# EAGLE design HX711 loadcell test hytech v1 (EAGLE 9.5.0)
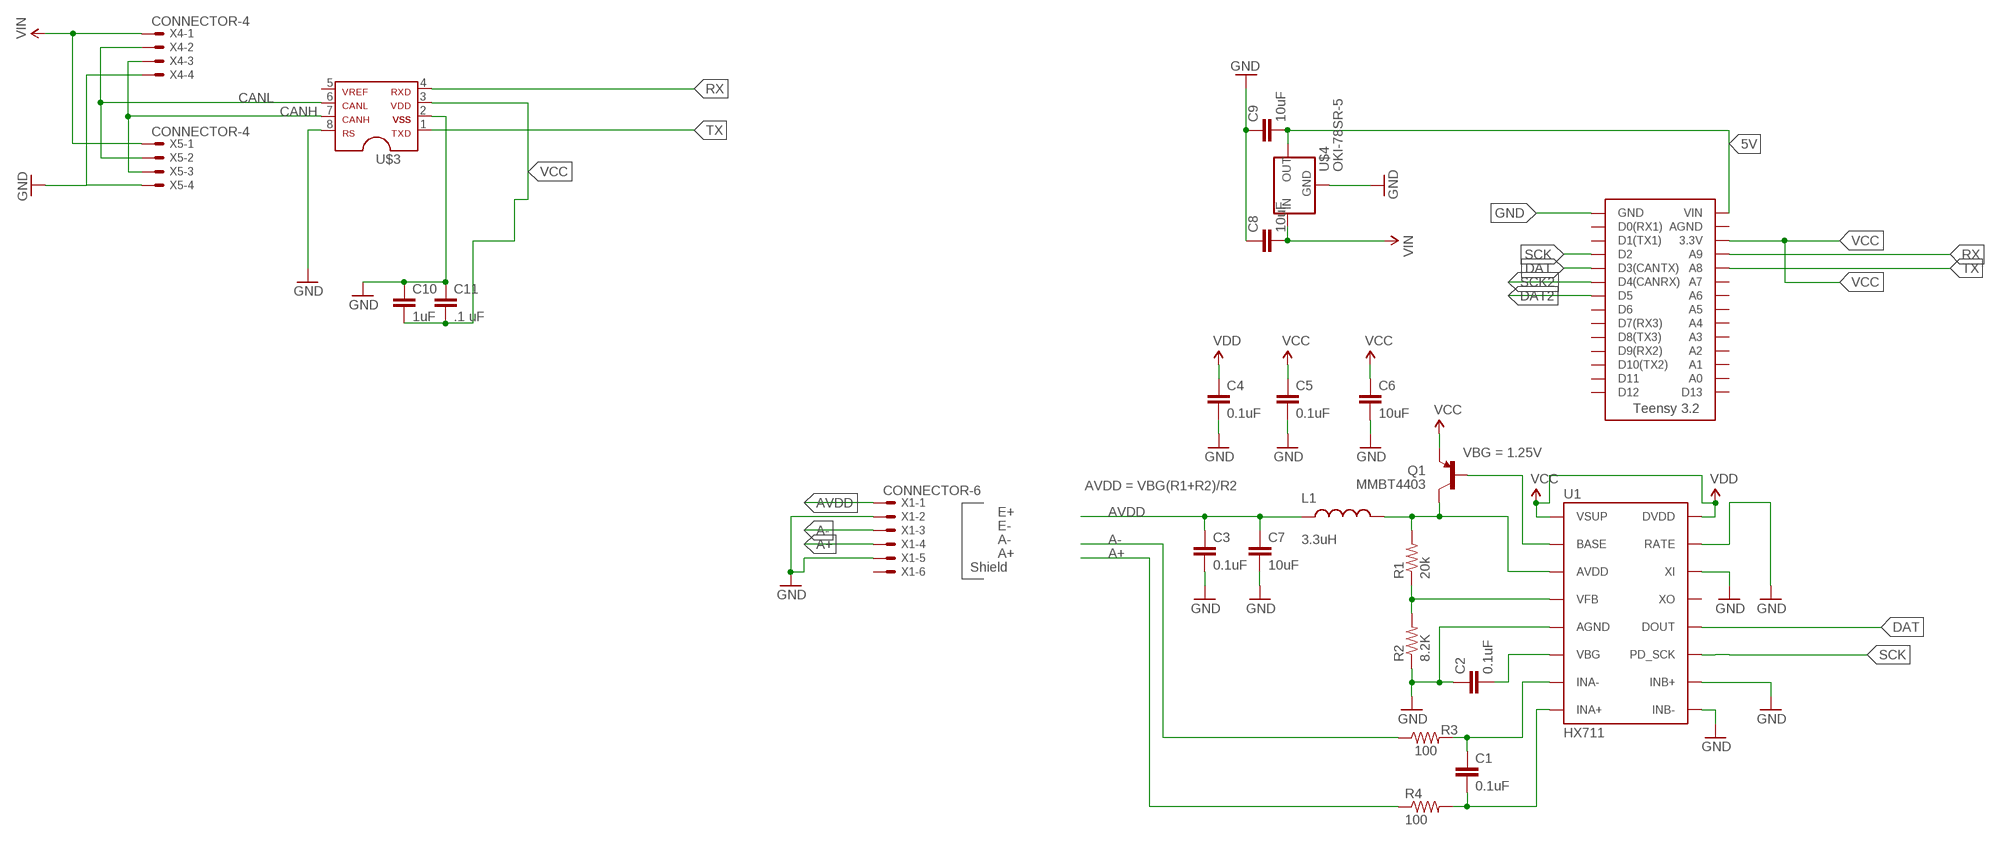
[diagram p0: schematic, sheet 1]

## Parts
C1  0.1uF  0.1UF-25V-5%(0603)  [0603-CAP]
C2  0.1uF  0.1UF-25V-5%(0603)  [0603-CAP]
C3  0.1uF  0.1UF-25V-5%(0603)  [0603-CAP]
C4  0.1uF  0.1UF-25V-5%(0603)  [0603-CAP]
C5  0.1uF  0.1UF-25V-5%(0603)  [0603-CAP]
C6  10uF  10UF50V20%(1210)  [1210]
C7  10uF  10UF50V20%(1210)  [1210]
C8  10uF  CAP0805  [0805]
C9  10uF  CAP0805  [0805]
C10  1uF  CAP0805  [0805]
C11  .1 uF  CAP0805  [0805]
L1  3.3uH  INDUCTOR0805-IND  [0805]
Q1  MMBT4403  TRANSISTOR_PNPMMBT4403  [SOT23-3]
R1  20k  20KOHM1/10W1%(0603)  [0603-RES]
R2  8.2K  8.2KOHM-1/10W-5%(0603)  [0603-RES]
R3  100  100OHM-1/10W-1%(0603)  [0603-RES]
R4  100  100OHM-1/10W-1%(0603)  [0603-RES]
U1  HX711  HX711HX711  [SO16]
U$1  TEENSY_3.2_SIMPLE  [TEENSY_3.2_SIMPLE]
U$3  MCP2551  [SOIC-08]
U$4  OKI-78SR-5  [OKI-78SR]
X1  CONNECTOR-6  [MINIFIT_5566-6]
X4  CONNECTOR-4  [MINIFIT_5566-4]
X5  CONNECTOR-4  [MINIFIT_5566-4]

## Nets
5V: C9.2 U$1.VIN U$4.3(OUT)
A+: R4.1 X1.4
A-: R3.1 X1.3
AVDD: C3.1 C7.1 L1.1 X1.1
CANH: U$3.7 X4.3 X5.3
CANL: U$3.6 X4.2 X5.2
DAT: U1.12(DOUT) U$1.D3(CANTX)
DAT2: U$1.D5
GND: C2.1 C3.2 C4.2 C5.2 C6.2 C7.2 C8.1 C9.1 C10.1 C11.1 R2.1 U1.5(AGND) U1.9(INB-) U1.10(INB+) U1.14(XI) U1.15(RATE) U$1.GND U$3.2 U$3.8 U$4.2(GND) X1.2 X1.5 X4.4 X5.4
N$2: C1.1 R3.2 U1.7(INA-)
N$3: C1.2 R4.2 U1.8(INA+)
N$4: Q1.1(B) U1.2(BASE)
N$5: L1.2 Q1.3(C) R1.2 U1.3(AVDD)
N$6: R1.1 R2.2 U1.4(VFB)
N$7: C2.2 U1.6(VBG)
RX: U$1.A9 U$3.4
SCK: U1.11(PD_SCK) U$1.D2
SCK2: U$1.D4(CANRX)
TX: U$1.A8 U$3.1
VCC: C5.1 C6.1 C10.2 C11.2 Q1.2(E) U1.1(VSUP) U1.16(DVDD) U$1.3.3V U$3.3 ; supply symbol labelled VDD
VDD: C4.1
VIN: C8.2 U$4.1(IN) X4.1 X5.1
Unconnected: U1.13(XO) U$1.A0 U$1.A1 U$1.A2 U$1.A3 U$1.A4 U$1.A5 U$1.A6 U$1.A7 U$1.AGND U$1.D0(RX1) U$1.D1(TX1) U$1.D6 U$1.D7(RX3) U$1.D8(TX3) U$1.D9(RX2) U$1.D10(TX2) U$1.D11 U$1.D12 U$1.D13 U$3.5 X1.6

## Notes on the sheet
- VBG = 1.25V
- AVDD = VBG(R1+R2)/R2
- E+
- E-
- A-
- A+
- Shield

## Library data of the parts
C1-C5 = SparkFun-Capacitors:0.1UF-25V-5%(0603): CAP-08604; PROD_ID: CAP-08604
C6 C7 = SparkFun-Capacitors:10UF50V20%(1210): CAP-09824; PROD_ID: CAP-09824
C8-C11 = HyTechDevices:CAP: Capacitor Standard 0603 ceramic capacitor, and 0.1" leaded capacitor.
L1 = SparkFun-Passives:INDUCTOR: Inductors Basic Inductor/Choke - 0603 and 1206. Footprints are not proven and vary greatly between part numbers. INDUCTOR POWER 3.3UH 4.0A SMD 0.197" L x 0.197" W x 0.177" H (5.00mm x 5.00mm x 4.50mm); PROD_ID: NDUC-13076
Q1 = SparkFun-DiscreteSemi:TRANSISTOR_PNP: Generic PNP BJT Double check pinouts against datasheets- not all devices are the same! MMBT3906 - 40V 200mA SOT-23 (TRANS-08052) MMBT4403 - 40V 600mA SOT-23 (TRANS-09245); PROD_ID: TRANS-09245
R1 = SparkFun-Resistors:20KOHM1/10W1%(0603): RES-09383; PROD_ID: RES-09383
R2 = SparkFun-Resistors:8.2KOHM-1/10W-5%(0603): RES-10646; PROD_ID: RES-10646
R3 R4 = SparkFun-Resistors:100OHM-1/10W-1%(0603): RES-07863; PROD_ID: RES-07863
U1 = Testing:HX711; PROD_ID: IC-12445
U$1 = HyTechDevices:TEENSY_3.2_SIMPLE: Simple version of the Teensy 3.2 board that only uses the 2 main rows of pins, not the inner pins or the pins opposite the usb port.
U$3 = HyTechDevices:MCP2551: MCP2551 High-Speed CAN Transceiver Product Webpage <https://www.microchip.com/wwwproducts/en/MCP2551> Datasheet <http://ww1.microchip.com/downloads/en/DeviceDoc/21667f.pdf> This device is outdated It is replaced by MCP2561. Comparison Page <https://www.microchip.com/wwwproducts/ProductCompare/MCP2551/MCP2561> Product Webpage <https://www.microchip.com/wwwproducts/en/MCP2561> Datasheet <http://ww1.microchip.com/downloads/en/DeviceDoc/20005167C.pdf>
U$4 = HyTechDevices:OKI-78SR-5: Murata OKI-78SR 5V 1.5A Non-Isolated Switching Regulator DC/DC - Datasheet <https://power.murata.com/data/power/oki-78sr.pdf>
X1 = HyTechDevices:CONNECTOR-6: Mini-Fit Junior connector 6 pole Source: http://www.molex.com; MPN: 95566-61002; OC_FARNELL: unknown; OC_NEWARK: 22K8620
X4 X5 = HyTechDevices:CONNECTOR-4: Mini-Fit Junior connector 4 pole Source: http://www.molex.com; OC_FARNELL: unknown; OC_NEWARK: unknown

## Board
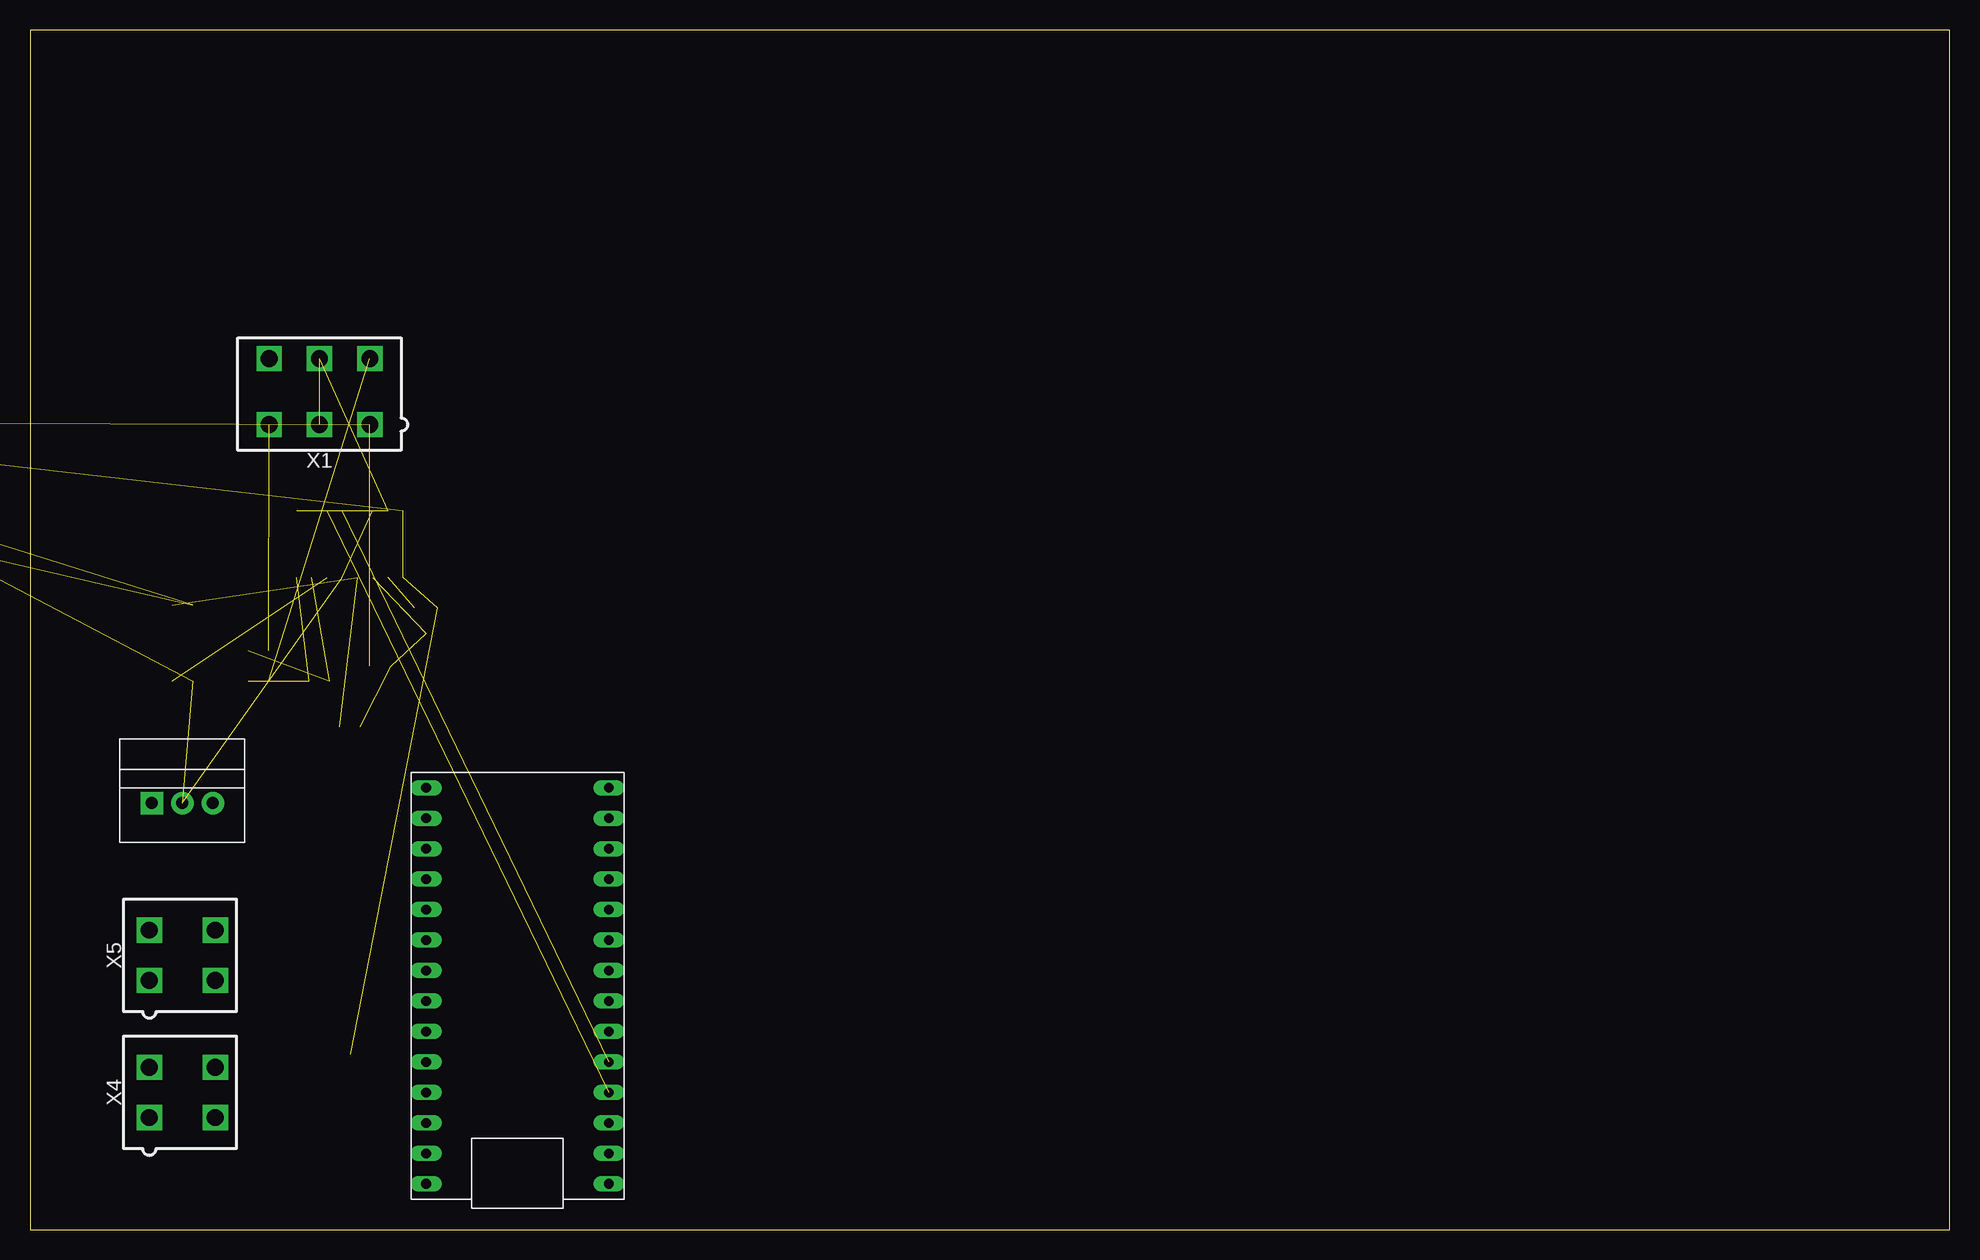
[diagram p1: board, top side]
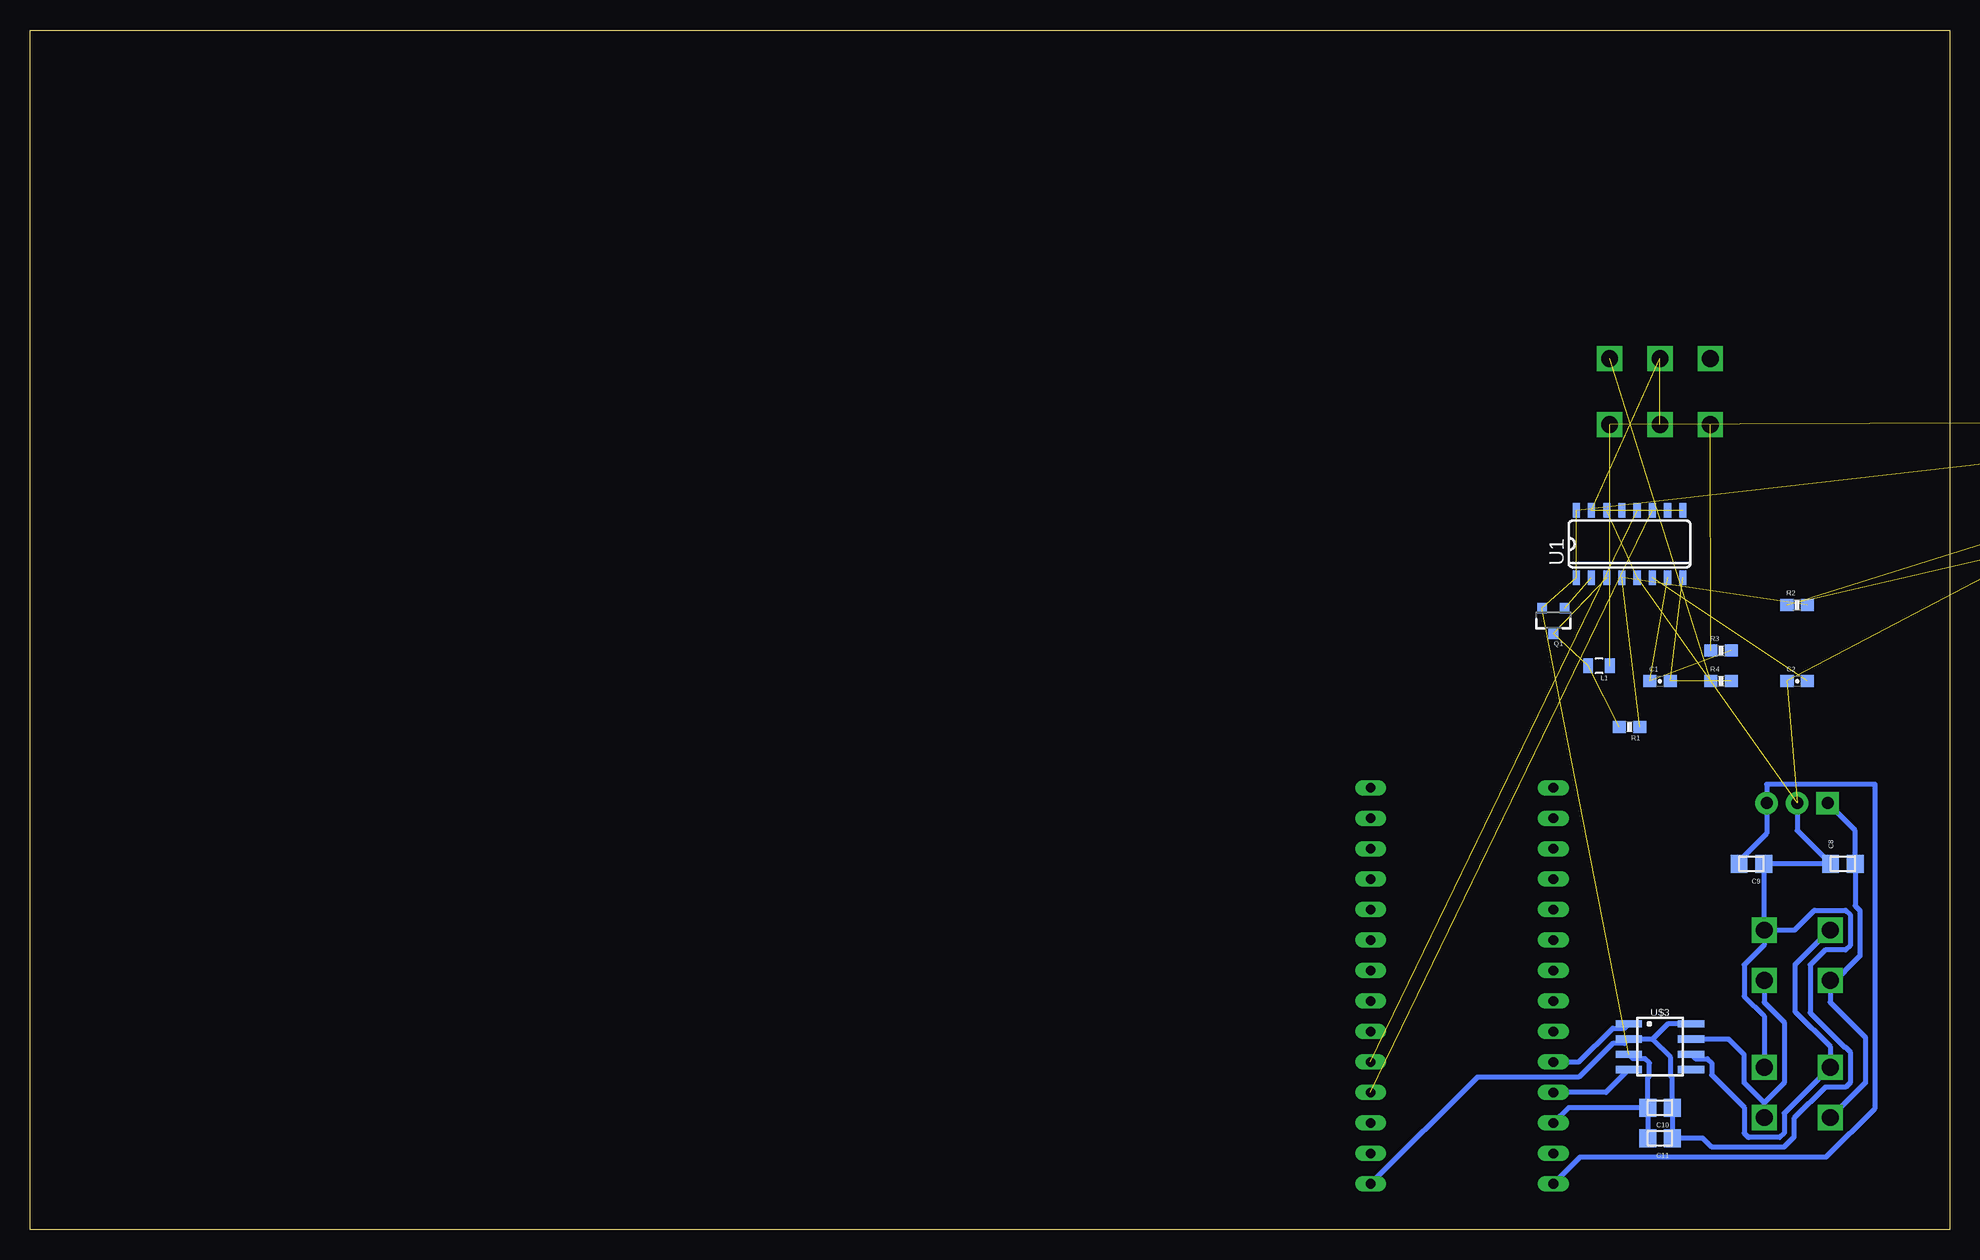
[diagram p2: board, bottom side, seen from below]

Size 160 x 100 mm. Coordinates in mm from the lower left corner, seen from the top.
Outline: 0,0 160,0 160,100 0,100 0,0
Copper layers (1*16): Top 0.035mm / dielectric 1.5mm / Bottom 0.035mm
Design rules "default *": minimum track width 6mil, minimum drill 0.35mm, track to track 16mil, track to pad 16mil, pad to pad 16mil, via to via 16mil, smd to smd 16mil, copper to edge 40mil, drill to drill 6mil, minimum pad ring 10mil, minimum via ring 8mil, stop-mask expansion 4mil, vias tented up to drill 0mil, thermal gap 10mil

### Footprints (pad centres in the part's own frame; a part is rotated, then mirrored left to right if it is on the bottom)
0603-CAP = smd 1.1 x 1: 1 -0.85,0; 2 0.85,0
1210 = smd 1.2 x 2: 1 -1.6,0; 2 1.6,0
0805 = smd 1.4 x 1.5: 1 -1.025,0; 2 1.025,0
0805' = smd 0.8 x 1.2: 1 -0.9,0; 2 0.9,0
SOT23-3 = smd 0.8 x 0.9: 1 -0.95,-1; 2 0.95,-1; 3 0,1.1
0603-RES = smd 1.1 x 1: 1 -0.85,0; 2 0.85,0
SO16 = smd 0.6 x 1.2: 1 -4.445,-2.8; 2 -3.175,-2.8; 3 -1.905,-2.8; 4 -0.635,-2.8; 5 0.635,-2.8; 6 1.905,-2.8; 7 3.175,-2.8; 8 4.445,-2.8; 9 4.445,2.8; 10 3.175,2.8; 11 1.905,2.8; 12 0.635,2.8; 13 -0.635,2.8; 14 -1.905,2.8; 15 -3.175,2.8; 16 -4.445,2.8
TEENSY_3.2_SIMPLE = drill 0.8 long: 3.3V 16.51,29.21; A0 16.51,3.81; A1 16.51,6.35; A2 16.51,8.89; A3 16.51,11.43; A4 16.51,13.97; A5 16.51,16.51; A6 16.51,19.05; A7 16.51,21.59; A8 16.51,24.13; A9 16.51,26.67; AGND 16.51,31.75; D0(RX1) 1.27,31.75; D1(TX1) 1.27,29.21; D2 1.27,26.67; D3(CANTX) 1.27,24.13; D4(CANRX) 1.27,21.59; D5 1.27,19.05; D6 1.27,16.51; D7(RX3) 1.27,13.97; D8(TX3) 1.27,11.43; D9(RX2) 1.27,8.89; D10(TX2) 1.27,6.35; D11 1.27,3.81; D12 1.27,1.27; D13 16.51,1.27; GND 1.27,34.29; VIN 16.51,34.29
SOIC-08 = smd 0.6 x 2.2: 1 -1.905,-2.6; 2 -0.635,-2.6; 3 0.635,-2.6; 4 1.905,-2.6; 5 1.905,2.6; 6 0.635,2.6; 7 -0.635,2.6; 8 -1.905,2.6
OKI-78SR = drill 1 pad 1.88 square: 1 -2.54,0 | drill 1 pad 1.88: 2 0,0; 3 2.54,0
MINIFIT_5566-6 = drill 1.4 square: 1 4.2,-2.75; 2 0,-2.75; 3 -4.2,-2.75; 4 4.2,2.75; 5 0,2.75; 6 -4.2,2.75
MINIFIT_5566-4 = drill 1.4 square: 1 2.1,-2.75; 2 -2.1,-2.75; 3 2.1,2.75; 4 -2.1,2.75

### Placement (x,y rotation side)
C1  24.13,45.72 0 bottom
C2  12.7,45.72 0 bottom
C3  -26.67,67.31 0 bottom  (outside the outline)
C4  -30.48,67.31 0 bottom  (outside the outline)
C5  -34.29,67.31 0 bottom  (outside the outline)
C6  -50.8,67.31 0 bottom  (outside the outline)
C7  -55.88,67.31 0 bottom  (outside the outline)
C8  8.89,30.48 0 bottom
C9  16.51,30.48 180 bottom
C10  24.13,10.16 180 bottom
C11  24.13,7.62 180 bottom
L1  3.3uH  [0805']  29.21,46.99 180 bottom
Q1  33.02,50.8 180 bottom
R1  26.67,41.91 180 bottom
R2  12.7,52.07 0 bottom
R3  19.05,48.26 0 bottom
R4  19.05,45.72 0 bottom
U1  26.67,57.15 0 bottom
U$1  49.53,38.1 180 top
U$3  24.13,15.24 270 bottom
U$4  12.7,35.56 0 top
X1  24.13,69.85 0 top
X4  12.7,11.43 270 top
X5  12.7,22.86 270 top

### Tracks (layer width: path | path; a pad name or v marks a point on that pad's centre or on a via)
5V
  Bottom 0.406: C9.2 17.54,30.74 15.24,33.04 U$4.3 15.24,37.11 6.21,37.11 6.21,10.11 10.27,6.04 30.79,6.04 U$1.VIN
A+  (1 unrouted)
A-  (1 unrouted)
AVDD  (3 unrouted)
CANH
  Bottom 0.406: X5.3 15.45,18.95 13.79,17.29 13.79,12.23 15.45,10.57 | X4.3 15.45,10.57 | 15.45,10.57 17.11,12.23 17.11,14.57 18.41,15.88 U$3.7
CANL
  Bottom 0.406: X5.2 9.98,24.96 12.88,22.06 12.88,18.19 9.95,15.26 X4.2 13.79,9.69 13.79,8.03 14.15,7.67 16.75,7.67 17.11,8.03 17.11,10.19 19.82,12.89 19.82,13.89 20.18,14.24 21.17,14.24 U$3.6
DAT  (1 unrouted)
GND  (14 unrouted)
  Bottom 0.406: X5.4 15.45,23.72 17.11,22.06 17.11,19.46 15.45,17.8 X4.4 | X5.4 12.91,24.96 11.25,26.62 8.65,26.62 8.29,26.26 8.29,23.66 8.65,23.3 10.37,23.3 11.61,22.06 11.61,18.07 8.73,15.19 8.65,15.19 8.29,14.83 8.29,12.23 8.65,11.87 10.37,11.87 12.98,9.27 12.98,7.69 13.81,6.86 19.81,6.86 20.57,7.62 C11.1 C10.1 23.11,12.65 23.24,12.78 23.24,14.35 24.77,15.88 | U$3.8 23.5,17.14 24.77,15.88 | 24.77,15.88 U$3.2 27.09,15.52 28.08,15.52 30.9,12.7 39.37,12.7 U$1.GND | X5.4 15.45,30.45 C9.1 C8.1 12.7,33.27 U$4.2
N$2  (2 unrouted)
N$3  (2 unrouted)
N$4  (1 unrouted)
N$5  (3 unrouted)
N$6  (2 unrouted)
N$7  (1 unrouted)
RX
  Bottom 0.406: U$3.4 28.64,11.43 U$1.A9
SCK  (1 unrouted)
TX
  Bottom 0.406: U$3.1 27.09,16.79 28.08,16.79 30.9,13.97 U$1.A8
VCC  (5 unrouted)
  Bottom 0.406: C10.2 C11.2 | C10.2 25.16,12.65 25.02,12.78 25.02,13.89 25.38,14.24 26.37,14.24 U$3.3 | C10.2 31.75,10.16 U$1.3.3V
VIN
  Bottom 0.406: X5.1 9.95,20.32 | 9.95,20.32 9.95,18.95 7.02,16.02 7.02,12.23 9.92,9.33 X4.1 | 9.95,20.32 7.48,22.79 7.48,26.6 7.87,26.99 C8.2 7.87,33.27 U$4.1